# EasyEDA Pro project ProPrj_picoballoon-tracker-v2_2025-12-21.epro, board PCB4
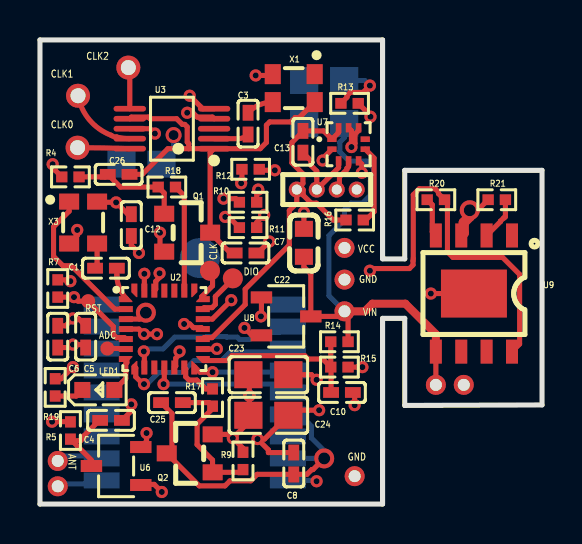
[diagram p11: board, top side]
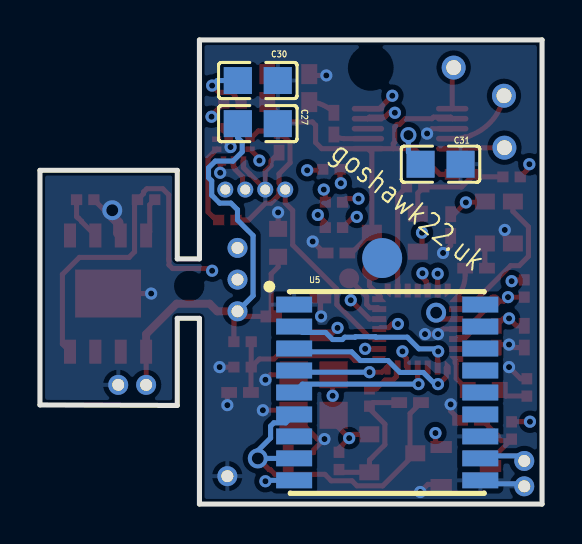
[diagram p12: board, bottom side, seen from below]

Outline 25.12 x 23.24 mm; copper layers: Top Layer, Inner1, Inner2, Bottom Layer. Coordinates in mm from the lower left corner of the outline.
Outline path: 0,23.24 17.14,23.24 17.14,12.28 18.25,12.28 18.25,16.71 25.12,16.71 25.12,4.96 18.25,4.94 18.25,9.3 17.14,9.3 17.14,0 0,0 0,23.24
Stack: Top Layer 0.035mm Outer layer thickness 1oz / Dielectric1 0.28mm 7628 RC49% 8.6mil / Inner1 0.035mm Inner layer thickness / Dielectric2 0.28mm 1.1mm H/HOZ Copper / Inner2 0.035mm Inner layer thickness / Dielectric3 0.28mm 7628 RC49% 8.6mil / Bottom Layer 0.035mm Outer layer thickness 1oz

## Design rules (mm)
template: JLCPCB Capability(Two Layers Board)
spacing copperThickness1oz (default): track to track 0.102, other pairs 0.152 to 0.3
spacing copperThickness2oz: track to track 0.203, other pairs 0.152 to 0.3
track width copperThickness1oz (default): min 0.127, default 0.254, max 2.54
track width copperThickness2oz: min 0.203, default 0.254, max 2.54
differential pair differentialPair (default): width min 0.127, default 0.254, max 2.54; gap min 0.152, default 0.152
via viaSize (default): diameter min 0.5, default 0.61, max 10; hole min 0.3, default 0.305, max 6.3

## Placement (name value [footprint] x y rotation side)
C3  100nF  [C0402]  10.41 19.05 270 top
C4  100nF  [C0402]  3.56 4.19 0 top
C5  10uF  [C0402]  2.29 8.38 90 top
C6  100nF  [C0402]  0.89 8.38 90 top
C7  100nF  [C0402]  10.29 12.57 180 top
C8  100nF  [C0402]  12.7 2.03 90 top
C10  100nF  [C0402]  15.11 5.59 0 top
C11  100nF  [C0402]  3.3 11.81 0 top
C12  100nF  [C0402]  4.57 13.97 90 top
C13  100nF  [C0402]  13.16 18.14 270 top
C22  1uF  [C0603]  13.21 13.08 90 top
C23  47uF  [C0805]  11.43 6.48 0 top
C24  47uF  [C0805]  11.43 4.45 0 top
C25  1uF  [C0402]  6.6 5.08 180 top
C26  1uF  [C0402]  3.94 16.51 180 top
C27  100uF  [C0805]  14.22 19.05 180 bottom
C30  47uF  [C0805]  14.22 21.21 180 bottom
C31  47uF  [C0805]  5.08 17.02 180 bottom
H12  SENSORS  [HDR-TH_ZX-PZ1.0-1-4PZZ]  14.35 15.75 0 top
LED1  KT-0603R  [LED0603-RD]  2.92 5.72 0 top
NOREF  -  [Pad_e696]  8.51 11.68 0 top
NOREF#2  -  [Pad_e3804]  1.88 17.85 0 top
NOREF#3  -  [Pad_e215]  15.24 12.83 0 top
NOREF#4  -  [Pad_e3703]  15.75 1.4 0 top
NOREF#5  -  [Pad_e724]  2.41 10.16 0 top
NOREF#6  -  [Pad_e3591]  0.89 2.16 0 top
NOREF#7  -  [Pad_e92]  21.21 5.97 0 top
NOREF#8  -  [Pad_e3803]  1.91 20.45 0 top
NOREF#9  -  [Pad_e698]  9.65 11.3 0 top
NOREF#10  -  [Pad_e3802]  4.42 21.86 0 top
NOREF#11  -  [Pad_e3801]  15.24 11.24 0 top
NOREF#12  -  [Pad_e85]  19.81 5.97 0 top
NOREF#13  -  [Pad_e474]  3.37 7.79 0 top
NOREF#14  -  [Pad_e3593]  0.89 0.89 0 top
NOREF#15  -  [Pad_e3800]  15.24 9.65 0 top
NOREF#16  -  [Pad_e3569]  8 12.32 0 top
Q1  AO3401A  [SOT-23_L2.9-W1.3-P1.90-LS2.4-BR]  7.37 13.59 180 top
Q2  AO3401A  [SOT-23_L2.9-W1.3-P1.90-LS2.4-BR]  7.49 2.54 0 top
R4  10K  [R0402]  1.52 16.38 0 top
R5  10K  [R0402]  1.52 3.68 90 top
R7  10K  [R0402]  0.89 10.8 270 top
R9  10K  [R0402]  10.16 2.16 270 top
R10  3.3K  [R0402]  10.41 15.11 0 top
R11  3.3K  [R0402]  10.41 13.84 0 top
R12  10K  [R0402]  10.54 16.76 0 top
R13  10K  [R0402]  15.49 20.07 0 top
R14  1M  [R0402]  14.99 8.13 0 top
R15  1M  [R0402]  14.99 6.86 180 top
R16  10K  [R0402]  15.75 14.22 0 top
R17  510  [R0402]  8.64 5.33 90 top
R18  510  [R0402]  6.35 15.88 180 top
R19  470  [R0402]  0.76 5.84 90 top
R20  10K  [R0402]  19.81 15.24 180 top
R21  10K  [R0402]  22.86 15.24 0 top
U2  STM32G071GBU6  [UFQFPN-28_L4.0-W4.0-P0.50-BL]  6.22 8.76 270 top
U3  SI5351A-B-GTR  [MSOP-10_L3.0-W3.0-P0.50-LS5.0-BL]  6.6 18.8 90 top
U5  ATGM336H-5NR32  [GPS-SMD_18P-L10.1-W9.7-P1.10-TL]  7.75 5.59 180 bottom
U6  MAX809STRG  [SOT-23-3_L2.9-W1.6-P1.90-LS2.8-BR]  3.81 1.91 0 top
U7  LPS22HBTR  [HLGA-10L_LPS22HBTR]  15.44 18.01 0 top
U8  XC6206P332MR-G  [SOT-23-3_L2.9-W1.6-P1.90-LS2.8-BR]  12.32 9.4 180 top
U9  TP4056-42-ESOP8  [ESOP-8_L4.9-W3.9-P1.27-LS6.0-BL-EP]  21.72 10.54 180 top
X1  26MHz  [OSC-SMD_4P-L2.5-W2.0-BL_X1G0042110003]  12.7 20.83 180 top
X3  27MHz  [OSC-SMD_4P-L2.5-W2.0-BL_X1G0042110003]  2.16 14.1 270 top

## Footprints (pads in the part's own frame, mm; a bottom-side part is the same pattern mirrored in y, then rotated)
C0402
  rect 0.79x0.54 smd: 1(-0.545,0) 2(0.545,0)
C0603
  rect 0.8x0.9 smd: 1(-0.7,0) 2(0.7,0)
C0805
  rect 1.41x1.35 smd: 1(-1,0) 2(1,0)
ESOP-8_L4.9-W3.9-P1.27-LS6.0-BL-EP
  rect 0.6x1.2 smd: 1(-1.905,-2.909) 2(-0.635,-2.909) 3(0.635,-2.909) 4(1.905,-2.909) 5(1.905,2.909) 6(0.635,2.909) 7(-0.635,2.909) 8(-1.905,2.909)
  rect 3.3x2.4 smd: 9(0,0)
GPS-SMD_18P-L10.1-W9.7-P1.10-TL
  rect 1.8x0.8 smd: 1(-4.657,4.4) 2(-4.657,3.3) 3(-4.657,2.2) 4(-4.657,1.1) 5(-4.657,0) 6(-4.657,-1.1) 7(-4.657,-2.2) 8(-4.657,-3.3) 9(-4.657,-4.4) 10(4.657,-4.4) 11(4.657,-3.3) 12(4.657,-2.2) 13(4.657,-1.1) 14(4.657,0) 15(4.657,1.1) 16(4.657,2.2) 17(4.657,3.3) 18(4.657,4.4)
HDR-TH_ZX-PZ1.0-1-4PZZ
  round 0.8 hole 0.5: 1(-1.5,0) 2(-0.5,0) 3(0.5,0) 4(1.5,0)
HLGA-10L_LPS22HBTR
  rect 0.465x0.28 smd: 1(-0.833,0.255) 2(-0.833,-0.245) 6(0.833,-0.245) 7(0.833,0.255)
  rect 0.28x0.465 smd: 3(-0.5,-0.828) 4(0,-0.828) 5(0.5,-0.828) 8(0.5,0.828) 9(0,0.828) 10(-0.5,0.828)
LED0603-RD
  rect 0.8x0.8 smd: 1(-0.799,0) 2(0.799,0)
MSOP-10_L3.0-W3.0-P0.50-LS5.0-BL
  oval 0.28x1.62 smd: 1(-1,-2.11) 2(-0.5,-2.11) 3(0,-2.11) 4(0.5,-2.11) 5(1,-2.11) 6(1,2.11) 7(0.5,2.11) 8(0,2.11) 9(-0.5,2.11) 10(-1,2.11)
OSC-SMD_4P-L2.5-W2.0-BL_X1G0042110003
  rect 0.8x1 smd: 1(-1.05,-0.7) 2(1.05,-0.7) 3(1.05,0.7) 4(-1.05,0.7)
Pad_e85
  round 1 hole 0.6: 1(0,0)
Pad_e92
  round 1 hole 0.6: 1(0,0)
Pad_e215
  round 1 hole 0.6: 1(0,0)
Pad_e474
  round 0.7 smd: 1(0,0)
Pad_e696
  round 1 smd: 1(0,0)
Pad_e698
  round 1 smd: 1(0,0)
Pad_e724
  round 0.7 smd: 1(0,0)
Pad_e3569
  round 2 smd far side: 1(0,0)
Pad_e3591
  round 1 hole 0.6: 1(0,0)
Pad_e3593
  round 1 hole 0.6: 1(0,0)
Pad_e3703
  round 1 hole 0.6: 1(0,0)
Pad_e3800
  round 1 hole 0.6: 1(0,0)
Pad_e3801
  round 1 hole 0.6: 1(0,0)
Pad_e3802
  round 1.2 hole 0.75: 1(0,0)
Pad_e3803
  round 1.2 hole 0.75: 1(0,0)
Pad_e3804
  round 1.2 hole 0.75: 1(0,0)
R0402
  rect 0.566x0.54 smd: 1(-0.433,0) 2(0.433,0)
SOT-23-3_L2.9-W1.6-P1.90-LS2.8-BR
  rect 1.07x0.6 smd: 1(1.235,-0.95) 2(1.235,0.95) 3(-1.235,0)
SOT-23_L2.9-W1.3-P1.90-LS2.4-BR
  rect 1x0.8 smd: 1(1.15,-0.95) 2(1.15,0.95) 3(-1.15,0)
UFQFPN-28_L4.0-W4.0-P0.50-BL
  custom 0.3x0.675 smd: 1(-1.5,-1.875) 7(1.5,-1.875) 15(1.5,1.875) 21(-1.5,1.875)
  rect 0.3x0.7 smd: 2(-1,-1.925) 3(-0.5,-1.925) 4(0,-1.925) 5(0.5,-1.925) 6(1,-1.925) 16(1,1.925) 17(0.5,1.925) 18(0,1.925) 19(-0.5,1.925) 20(-1,1.925)
  custom 0.675x0.3 smd: 8(1.875,-1.5) 14(1.875,1.5) 22(-1.875,1.5) 28(-1.875,-1.5)
  rect 0.7x0.3 smd: 9(1.925,-1) 10(1.925,-0.5) 11(1.925,0) 12(1.925,0.5) 13(1.925,1) 24(-1.925,0.5) 25(-1.925,0) 26(-1.925,-0.5) 27(-1.925,-1)
  custom 0.7x0.3 smd: 23(-1.925,1)

## Nets
GND: C4.2 C5.1 C6.1 C7.1 C8.2 C10.2 C12.1 C13.2 C22.2 C23.2 C24.2 C27.2 C30.2 C31.2 H12.2 NOREF#4.1 NOREF#7.1 NOREF#11.1 NOREF#14.1 R15.1 R19.2 R21.1 U2.4 U3.8 U5.1 U5.10 U5.12 U6.1 U7.3 U7.5 U7.8 U7.9 U8.1 U9.3 U9.9 X1.2 X3.2
VCC: C5.2 C6.2 C12.2 C23.1 C24.1 C30.1 C31.1 NOREF#3.1 Q1.2 Q2.2 R4.1 R5.2 R7.1 R9.1 R10.2 R11.2 R12.1 R13.1 U2.3 U8.2 X3.4
VIN: C22.1 C27.1 NOREF#12.1 NOREF#15.1 R14.2 U8.3 U9.5
VIN_MON: C10.1 R14.1 R15.2 U2.15
ADC: NOREF#13.1 U2.6
BOOT/SWCLK/TX: NOREF.1 U2.21
BVIN: R20.2 U9.4
CHG_EN: R20.1 U2.16 U9.8
GPS_ANT: NOREF#6.1 U5.11
GPS_ON: U2.11 U5.5
GPS_RST: U2.12 U5.9
GPS_RX: U2.8 U5.3
GPS_TX: U2.9 U5.2
GPS_VCC: C8.1 C25.2 Q2.3 U5.6 U5.8
GPS_VCC_ON: R17.2 U2.13
OSC_EN: U2.2 X3.1
PPS: U2.14 U5.4
RST: NOREF#5.1 R7.2 U2.5 U6.2
SENSOR_SCL: H12.4 R13.2 U2.18 U7.2
SENSOR_SDA: H12.3 R12.2 U2.19 U7.4
SENSOR_VCC: C13.1 H12.1 R16.1 U2.17 U7.1 U7.10
SWDIO: NOREF#9.1 U2.20
VFO_CLK0: NOREF#2.1 U3.10
VFO_CLK1: NOREF#8.1 U3.9
VFO_CLK2: NOREF#10.1 U3.6
VFO_ON: R18.1 U2.23
VFO_SCL: R11.1 U2.26 U3.4
VFO_SDA: R10.1 U2.27 U3.5
VFO_VCC: C7.2 C26.1 Q1.3 U3.1 U3.7 X1.4
$1N1023: C11.2 U2.1
$1N1361: C3.1 X1.3
$1N1366: C3.2 U3.2
$1N13574: C4.1 R5.1 U6.3
$1N14906: R16.2 U7.6
$1N19967: C11.1 X3.3
$1N21669: C25.1 Q2.1 R9.2 R17.1
$1N21797: C26.2 Q1.1 R4.2 R18.2
$1N29798: LED1.1 R19.1
$1N29803: LED1.2 U2.7
$1N31369: R21.2 U9.2

Pads without a net: NOREF#16 1; U2 10 22 24 25 28; U3 3; U5 7 13 14 15 16 17 18; U7 7; U9 1 6 7; X1 1

## Via types
v1: diameter 0.61, hole 0.305, Top Layer to Bottom Layer, 55 vias
v2: diameter 1, hole 0.6, Top Layer to Bottom Layer, 3 vias
v3: diameter 0.8, hole 0.5, Top Layer to Bottom Layer, 1 via

## Routing (per net, layer and track width the routed paths; a pad name or vN(x,y) marks a point on that pad's centre or on a via; arc(x,y) is an arc through that point)
GND: length 35.9
  Top Layer w0.254: C10.2 15.75,5.5 v1(15.75,4.95) ; v1(5.86,8.51) v1(5.21,8.51) 4.95,8.76 U2.4 ; 4.49,18.8 5.51,18.8 v1(5.75,18.55) ; R15.1 v1(16.13,6.86) ; C8.2 11.43,2.58 11.43,2.71 v1(10.89,3.26) 11.24,3.26 C24.2 12.68,4.7 v1(13.97,4.7) ; C12.1 4.57,12.95 v1(4.95,12.57) ; U8.1 11.08,9.43 v1(11.06,9.4) ; v1(13.21,14.61) C22.2 ; X1.2 11.58,21.46 v1(10.79,21.46) ; U7.3 14.94,16.84 14.63,16.53 14.63,16.53 H12.2 13.85,16.67 13.56,16.96 13.56,17.19 C13.2 ; v1(1.86,13.73) 1.86,13.45 X3.2 ; R21.1 21.9,14.71 v2(21.51,14.71) ; C6.1 1.5,7.84 v1(1.65,7.99) 2.14,7.99 C5.1 ; v1(16.11,16.59) 16.11,17.02 U7.5 ; v1(13.84,6.22) 13.59,6.48 C23.2 ; v1(6.1,0.61) 5.71,0.99 5.08,0.99 U6.1 ; v1(1.65,6.86) 1.07,6.28 R19.2 ; U7.9 15.59,18.7 v1(15.59,17.88) 15.77,18.06 15.77,18.52 15.94,18.7 U7.8 ; C7.1 10.9,12.57 v1(11.48,13.15) ; v1(19.56,10.54) U9.9 ; v1(4.57,4.99) 4.57,4.66 C4.2
  Top Layer w0.508: U9.3 21.21,13.58 21.21,14.1 21.51,14.4 v2(21.51,14.71)
  Bottom Layer w0.254: U5.10 2.92,1.02 1.02,1.02 NOREF#14.1
VCC: length 22
  Top Layer w0.254: R13.1 15.36,20.37 15.36,20.45 15.53,20.62 16.17,20.62 v1(16.51,20.95) ; R11.2 10.85,14.1 v1(11.22,14.48) ; v1(9.65,3.3) 10.16,2.79 R9.1 ; v1(9.65,3.3) 10.43,4.08 C24.1 10.48,4.49 v1(10.48,5.42) 10.48,6.43 C23.1 ; v1(9.65,3.3) 9.46,3.49 Q2.2 ; v1(6.01,13.59) 6.01,12.85 Q1.2 ; C5.2 1.92,9.3 v1(1.65,9.3) 1.28,8.93 C6.2 ; v1(0.6,4.12) 1.51,4.12 R5.2 ; v1(0.63,17.02) 0.76,16.89 0.76,16.71 R4.1 ; 2.81,15.11 3.8,15.11 v1(3.81,15.1) 4.4,14.52 C12.2 ; v1(10.23,8.82) 10.61,8.45 U8.2 ; R7.1 1.45,11.23 v1(1.52,11.16) ; v2(5.3,9.58) 4.98,9.26 U2.3 ; 10.11,16.76 10.11,16.11 v1(10.07,16.06) ; R10.2 10.85,15.67 v1(10.92,15.75)
  Bottom Layer w0.254: v1(16.51,20.95) 16.26,21.21 C30.1 ; C31.1 6.69,17.62 v3(6.69,18.48)
VIN: length 26.7
  Top Layer w0.254: C22.1 13.21,11.87 13.55,11.53 U8.3 14.99,9.4 NOREF#15.1 15.42,9.47 R14.2 ; U9.5 NOREF#12.1
  Top Layer w0.4: U9.5 19.81,8.51 18.29,10.03 16.64,10.03 16.26,9.65 NOREF#15.1
  Bottom Layer w0.254: NOREF#15.1 14.46,10.43 14.46,13.45 15.24,14.22 15.24,14.74 15.57,15.07 16.13,15.07 16.53,15.47 16.53,16.19 16.69,16.35 16.69,16.83 16.35,17.17 15.46,17.17 15,17.64 15,18.12 15.24,18.36 15.24,19.03 C27.1
VIN_MON: length 9.4
  Top Layer w0.254: R15.2 14.15,7.26 13.42,7.26 13.25,7.43 9.61,7.43 9.37,7.19 8.17,7.19 U2.15 ; R15.2 14.57,6.84 14.57,5.59 ; R15.2 R14.1
ADC: length 0.9
  Top Layer w0.254: U2.6 4.27,7.79 NOREF#13.1
BOOT/SWCLK/TX: length 1.5
  Top Layer w0.254: 8.64,11.56 8.64,10.93 8.1,10.39 U2.21
BVIN: length 2
  Top Layer w0.254: R20.2 19.63,14.99 19.63,13.63 U9.4
CHG_EN: length 29.9
  Top Layer w0.254: v1(8.85,7.77) 8.84,7.76 U2.16 ; v1(16.51,11.68) 16.62,11.79 18.49,11.79 18.67,11.97 18.67,12.18 arc(18.68,12.23) 18.68,12.28 18.68,15.49 18.98,15.79 19.78,15.79 19.94,15.63 19.94,15.54 R20.1 20.39,15.09 20.39,12.63 20.67,12.35 23.15,12.35 24,11.5 24,8.01 U9.8
  Inner1 w0.254: v1(8.85,7.77) 15.01,7.77 16.51,9.27 v1(16.51,11.68)
GPS_ANT: length 2.4
  Bottom Layer w0.254: NOREF#6.1 1.14,2.41 2.96,2.41 U5.11
GPS_ON: length 7.2
  Top Layer w0.254: U2.11 6.22,6.04 v1(6.18,6.01)
  Bottom Layer w0.254: v1(6.18,6.01) 11.99,6.01 U5.5
GPS_RST: length 12.4
  Top Layer w0.254: v1(6.98,7.64) 6.98,7.49 6.79,7.3 6.79,6.91 U2.12
  Inner1 w0.254: v1(13.84,1.14) 13.84,1.3 10.3,4.84 9.58,4.84 8.05,6.36 8.05,7.09 7.49,7.64 v1(6.98,7.64)
  Bottom Layer w0.254: U5.9 13.8,1.19 v1(13.84,1.14)
GPS_RX: length 9
  Top Layer w0.254: U2.8 4.79,6.82 4.79,6.37 5.16,6.01 v1(5.21,6.01)
  Bottom Layer w0.254: U5.3 12.24,7.62 9.52,7.62 9.09,7.19 7.71,7.19 7.11,6.59 5.94,6.59 5.36,6.01 v1(5.21,6.01)
GPS_TX: length 8.7
  Top Layer w0.254: U2.9 5.22,7.62 v1(5.2,7.64)
  Bottom Layer w0.254: v1(5.2,7.64) 5.32,7.77 6.16,7.77 6.74,8.36 8.32,8.36 8.34,8.38 9.33,8.38 9.36,8.36 9.87,8.36 9.99,8.24 10.48,8.24 10.83,8.59 11.98,8.59 12.28,8.89 U5.2
GPS_VCC: length 17.1
  Top Layer w0.254: C25.2 6.6,4.53 6.6,2.8 Q2.3 7.97,0.91 9.26,0.91 9.51,1.16 10.55,1.16 10.87,1.49 13.36,1.49 13.6,1.73 13.66,1.73 v2(14.22,2.29)
  Bottom Layer w0.254: U5.8 12.41,2.29 v2(14.22,2.29) 14.22,2.67 13.58,3.31 13.58,3.9 13.42,4.07 12.83,4.07 U5.6
GPS_VCC_ON: length 2.1
  Top Layer w0.254: U2.13 7.29,6.77 7.29,6.37 7.46,6.21 7.85,6.21 8.29,5.77 R17.2
OSC_EN: length 7.8
  Top Layer w0.254: X3.1 1.46,14.66 0.68,13.88 0.68,12.4 1.15,11.94 1.57,11.94 3.75,9.76 U2.2
PPS: length 4.8
  Top Layer w0.254: v1(8.64,6.6) 8.01,6.6 U2.14
  Bottom Layer w0.254: U5.4 12.32,6.6 v1(8.64,6.6)
RST: length 13.7
  Top Layer w0.254: R7.2 v1(1.7,10.36) 1.91,10.16 2.4,10.16 ; 2.4,10.16 3.67,8.89 3.67,8.5 3.83,8.33 4.23,8.33 U2.5 ; 2.4,10.16 NOREF#5.1 ; U6.2 5.33,3.14 v1(5.33,3.56)
  Inner1 w0.254: v1(5.33,3.56) 4.48,4.41 4.33,4.41 2.23,6.5 2.23,9.54 1.7,10.07 v1(1.7,10.36)
SENSOR_SCL: length 21
  Top Layer w0.254: v1(7.21,9.02) 7.5,9.02 7.68,8.83 8.08,8.83 U2.18 ; v1(14.14,17.2) 14.14,17.3 U7.2 ; R13.2 16.54,19.45 v1(16.54,19.4)
  Inner1 w0.254: v1(7.21,9.02) 7.59,8.64 8.83,8.64 9.92,9.73 10.56,9.73 10.81,9.98 10.97,9.98 15.85,14.86 H12.4 15.6,15.75 15.53,15.82 15.53,16.03 15.13,16.43 14.92,16.43 v1(14.14,17.2) 14.14,17.45 16.21,19.52 16.41,19.52 v1(16.54,19.4)
SENSOR_SDA: length 16.6
  Top Layer w0.254: v1(9.57,10.21) 8.63,9.26 U2.19 ; U7.4 15.44,16.9 15.36,16.82 15.36,16.76 14.99,16.38 14.99,15.88 H12.3 ; R12.2 11.02,16.71 v1(11.75,16.71)
  Inner1 w0.254: v1(9.57,10.21) 9.65,10.21 9.77,10.08 10.33,10.08 15.36,15.11 15.36,15.24 H12.3 14.81,15.75 14.13,16.43 12.04,16.43 v1(11.75,16.71)
SENSOR_VCC: length 18.8
  Top Layer w0.254: H12.1 12.85,15.07 12.48,14.7 12.48,12.97 10.27,10.76 10.27,9.99 8.61,8.33 8.22,8.33 U2.17 ; H12.1 13.16,16.06 13.16,16.54 12.61,17.09 12.61,18.11 13.16,18.66 C13.1 14.19,18.69 U7.1 14.94,18.6 U7.10 ; H12.1 13.16,15.75 13.17,15.73 13.17,15.47 13.57,15.07 13.83,15.07 14.68,14.22 R16.1
SWDIO: length 2.6
  Top Layer w0.254: U2.20 8.22,9.83 8.61,9.83 8.78,10 8.78,10.39 9.65,11.27 9.65,11.33 9.76,11.43
VFO_CLK0: length 2.6
  Top Layer w0.254: NOREF#2.1 arc(3.19,17.83) 4.49,17.8
VFO_CLK1: length 3.7
  Top Layer w0.254: 4.49,18.3 arc(4.17,18.32) 3.85,18.38 3.82,18.38 arc(3.69,18.4) 3.57,18.46 arc(2.48,19.24) NOREF#8.1
VFO_CLK2: length 2.1
  Top Layer w0.254: 4.49,19.8 4.49,21.68 arc(4.48,21.78) NOREF#10.1
VFO_ON: length 5.4
  Top Layer w0.254: U2.23 7.22,15.44 R18.1
VFO_SCL: length 13.8
  Top Layer w0.254: v1(5.98,11.56) 5.98,11.34 5.79,11.15 5.79,10.76 U2.26 ; U3.4 8.63,19.38 7.87,19.38 7.65,19.59 v1(7.37,19.59) ; R11.1 9.44,14.38 v1(9.27,14.38)
  Inner1 w0.254: v1(9.27,14.38) 8.81,14.38 v1(5.98,11.56)
  Inner2 w0.254: v1(9.27,14.38) 7.37,16.29 v1(7.37,19.59)
VFO_SDA: length 14.8
  Top Layer w0.254: U3.5 8.14,19.8 v1(7.49,20.45) ; R10.1 9.8,15.29 v1(9.18,15.29) ; v1(5.22,11.53) U2.27
  Inner1 w0.254: v1(5.22,11.53) 5.4,11.71 5.4,11.84 8.85,15.29 8.98,15.29 9.13,15.44 9.18,15.39 v1(9.18,15.29)
  Inner2 w0.254: v1(7.49,20.45) 9.18,18.76 v1(9.18,15.29)
VFO_VCC: length 21.4
  Top Layer w0.254: C7.2 9.53,12.57 Q1.3 8.52,17.6 U3.1 ; 4.48,16.51 5.12,16.51 6.4,17.8 7.44,17.8 ; U3.1 7.44,17.8 ; U3.1 11.02,17.8 11.33,18.11 11.33,18.97 11.49,19.14 12.55,19.14 12.77,19.36 12.98,19.36 X1.4 ; 7.44,17.8 7.44,18.05 7.37,18.12 7.37,18.89 7.24,19.01 7.12,19.01 6.84,19.3 5.51,19.3 5.43,19.38 4.57,19.38 4.49,19.3
$1N1023: length 1.7
  Top Layer w0.254: C11.2 3.85,11.47 arc(3.98,10.82) U2.1
$1N1361: length 1.4
  Top Layer w0.254: C3.1 10.45,19.63 arc(11,20) X1.3
$1N1366: length 1.8
  Top Layer w0.254: U3.2 9.91,18.3 arc(10.18,18.35) C3.2
$1N13574: length 3.4
  Top Layer w0.254: 1.6,3.17 2.04,3.17 2.2,3.34 2.2,3.42 2.97,4.19 C4.1 ; 1.6,3.17 2.57,2.2 2.57,2.16 ; 1.6,3.17 R5.1
$1N14906: length 4
  Top Layer w0.254: R16.2 16.31,14.22 16.72,14.63 16.72,17.33 U7.6
$1N19967: length 1.3
  Top Layer w0.254: X3.3 2.86,12.06 arc(2.83,11.92) C11.1
$1N21669: length 7.1
  Top Layer w0.254: C25.1 8.46,5.08 R17.1 8.64,4.78 7.86,4.01 7.86,2.97 8.64,2.2 8.64,1.6 Q2.1 10.02,1.59 R9.2
$1N21797: length 5.7
  Top Layer w0.254: Q1.1 6.22,15.58 R18.2 4.03,15.88 C26.2 3.26,16.38 R4.2
$1N29798: length 1.5
  Top Layer w0.254: LED1.1 1.82,5.41 R19.1
$1N29803: length 1.8
  Top Layer w0.254: U2.7 4.35,7.08 4.29,7.03 4.29,6.29 LED1.2
$1N31369: length 2.2
  Top Layer w0.254: R21.2 23.29,14.39 23.23,14.33 23.21,14.33 23.04,14.17 23.04,14.14 U9.2

## Copper pours and planes (outline as drawn; the poured copper is in the pictures)
GND on Bottom Layer: 0,23.24 17.14,23.24 17.14,0 0,0
GND on Bottom Layer: 25.12,16.71 25.12,4.96 18.25,4.96 18.25,9.3 16.45,9.3 16.45,12.26 16.51,12.32 18.25,12.32 18.25,16.71
GND on Inner1: 0,23.37 17.14,23.37 17.14,0.13 0,0.13
VCC on Inner2: 0,23.24 17.14,23.24 17.14,0 0,0

## Text on the board
Bottom Silkscreen Layer: goshawk22.uk
Top Silkscreen Layer: CLK1 | CLK0 | CLK2 | ADC | DIO | GND | VCC | VIN | CLK | ANT | RST
